# Altium schematic sheet top.SchDoc
size A4; SheetNumber: 1; SheetTotal: 1
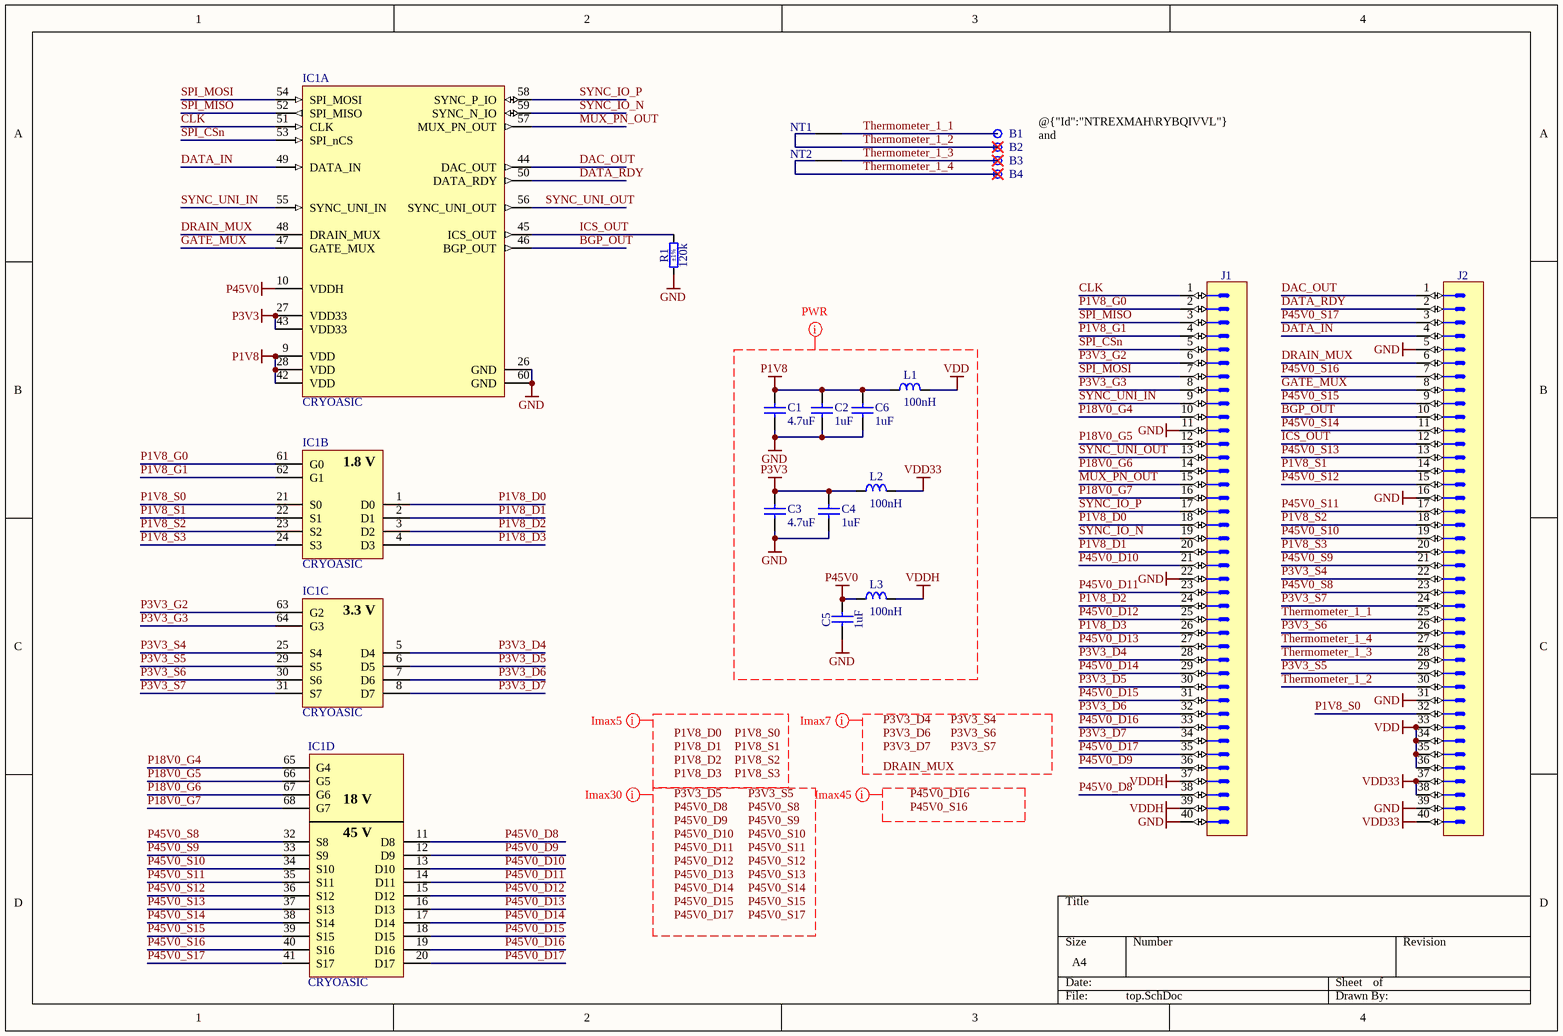
[diagram p0: top.SchDoc]

## Parts
B1  Plated Hole  [c100h50]  (value not drawn)  (no BOM)
B2  Plated Hole  [c100h50]  (value not drawn)  (no BOM)
B3  Plated Hole  [c100h50]  (value not drawn)  (no BOM)
B4  Plated Hole  [c100h50]  (value not drawn)  (no BOM)
C1  4.7uF  [CAPC1005X55N]
C2  1uF  [CAPC1005X55N]
C3  4.7uF  [CAPC1005X55N]
C4  1uF  [CAPC1005X55N]
C5  1uF  [CAPC2013X145N]
C6  1uF  [CAPC1005X55N]
IC1  CRYOASIC  [FP-FJ0068A-IPC_A]  (parts A,B,C,D of 4)
J1  Header 40  [SAMTEC_HDWM-20-54-L-D-335-SM-P]  (value not drawn)
J2  Header 40  [SAMTEC_HDWM-20-54-L-D-335-SM-P]  (value not drawn)
L1  100nH  [INDC1005X55N]
L2  100nH  [INDC1005X55N]
L3  100nH  [INDC1005X55N]
NT1  Net Tie  [Net Tie]  (value not drawn)  (net tie, no BOM)
NT2  Net Tie  [Net Tie]  (value not drawn)  (net tie, no BOM)
R1  120k  Tolerance: ±1%  [RESC1005X40N]

## Nets
GND: C1.2 C2.2 C3.2 C4.2 C5.1 C6.2 IC1.26(GND) IC1.60(GND) J1.11 J1.22 J1.40 J2.5 J2.16 J2.31 J2.39 R1.1
P1V8: C1.1 C2.1 C6.1 IC1.9(VDD) IC1.28(VDD) IC1.42(VDD) L1.1
P3V3: C3.1 C4.1 IC1.27(VDD33) IC1.43(VDD33) L2.1
P45V0: C5.2 IC1.10(VDDH) L3.1
VDD: J2.33 J2.34 J2.35 J2.36 L1.2
VDD33: J2.37 J2.38 J2.40 L2.2
VDDH: J1.37 J1.39 L3.2
BGP_OUT: IC1.46(BGP_OUT) J2.10
CLK: IC1.51(CLK) J1.1
DAC_OUT: IC1.44(DAC_OUT) J2.1
DATA_IN: IC1.49(DATA_IN) J2.4
DATA_RDY: IC1.50(DATA_RDY) J2.2
DRAIN_MUX: IC1.48(DRAIN_MUX) J2.6
GATE_MUX: IC1.47(GATE_MUX) J2.8
ICS_OUT: IC1.45(ICS_OUT) J2.12 R1.2
MUX_PN_OUT: IC1.57(MUX_PN_OUT) J1.15
P1V8_D0: IC1.1(D0) J1.18
P1V8_D1: IC1.2(D1) J1.20
P1V8_D2: IC1.3(D2) J1.24
P1V8_D3: IC1.4(D3) J1.26
P1V8_G0: IC1.61(G0) J1.2
P1V8_G1: IC1.62(G1) J1.4
P1V8_S0: IC1.21(S0) J2.32
P1V8_S1: IC1.22(S1) J2.14
P1V8_S2: IC1.23(S2) J2.18
P1V8_S3: IC1.24(S3) J2.20
P3V3_D4: IC1.5(D4) J1.28
P3V3_D5: IC1.6(D5) J1.30
P3V3_D6: IC1.7(D6) J1.32
P3V3_D7: IC1.8(D7) J1.34
P3V3_G2: IC1.63(G2) J1.6
P3V3_G3: IC1.64(G3) J1.8
P3V3_S4: IC1.25(S4) J2.22
P3V3_S5: IC1.29(S5) J2.29
P3V3_S6: IC1.30(S6) J2.26
P3V3_S7: IC1.31(S7) J2.24
P18V0_G4: IC1.65(G4) J1.10
P18V0_G5: IC1.66(G5) J1.12
P18V0_G6: IC1.67(G6) J1.14
P18V0_G7: IC1.68(G7) J1.16
P45V0_D8: IC1.11(D8) J1.38
P45V0_D9: IC1.12(D9) J1.36
P45V0_D10: IC1.13(D10) J1.21
P45V0_D11: IC1.14(D11) J1.23
P45V0_D12: IC1.15(D12) J1.25
P45V0_D13: IC1.16(D13) J1.27
P45V0_D14: IC1.17(D14) J1.29
P45V0_D15: IC1.18(D15) J1.31
P45V0_D16: IC1.19(D16) J1.33
P45V0_D17: IC1.20(D17) J1.35
P45V0_S8: IC1.32(S8) J2.23
P45V0_S9: IC1.33(S9) J2.21
P45V0_S10: IC1.34(S10) J2.19
P45V0_S11: IC1.35(S11) J2.17
P45V0_S12: IC1.36(S12) J2.15
P45V0_S13: IC1.37(S13) J2.13
P45V0_S14: IC1.38(S14) J2.11
P45V0_S15: IC1.39(S15) J2.9
P45V0_S16: IC1.40(S16) J2.7
P45V0_S17: IC1.41(S17) J2.3
SPI_CSn: IC1.53(SPI_nCS) J1.5
SPI_MISO: IC1.52(SPI_MISO) J1.3
SPI_MOSI: IC1.54(SPI_MOSI) J1.7
SYNC_IO_N: IC1.59(SYNC_N_IO) J1.19
SYNC_IO_P: IC1.58(SYNC_P_IO) J1.17
SYNC_UNI_IN: IC1.55(SYNC_UNI_IN) J1.9
SYNC_UNI_OUT: IC1.56(SYNC_UNI_OUT) J1.13
Thermometer_1_1: B1.1 J2.25 NT1.2
Thermometer_1_2: B2.1 J2.30 NT1.1
Thermometer_1_3: B3.1 J2.28 NT2.2
Thermometer_1_4: B4.1 J2.27 NT2.1

## Layout directives
net class PWR: GND, P1V8, P3V3, P45V0, VDD, VDD33, VDDH
net class Imax5: P1V8_D0, P1V8_D1, P1V8_D2, P1V8_D3, P1V8_S0, P1V8_S1, P1V8_S2, P1V8_S3
net class Imax7: DRAIN_MUX, P3V3_D4, P3V3_D6, P3V3_D7, P3V3_S4, P3V3_S6, P3V3_S7
net class Imax30: P3V3_D5, P3V3_S5, P45V0_D8, P45V0_D9, P45V0_D10, P45V0_D11, P45V0_D12, P45V0_D13, P45V0_D14, P45V0_D15, P45V0_D17, P45V0_S8, P45V0_S9, P45V0_S10, P45V0_S11, P45V0_S12, P45V0_S13, P45V0_S14, P45V0_S15, P45V0_S17
net class Imax45: P45V0_D16, P45V0_S16

## Notes on the sheet
- @{"Id":"NTREXMAH\RYBQIVVL"} and @{"Id":"NTREXMAH\FSQBBUAX"}: V+/- to diode
  @{"Id":"NTREXMAH\DWSTYFZM"} and @{"Id":"NTREXMAH\UVDVJTMM"}: I+/- to diode
- Labels drawn without touching a wire or pin: DRAIN_MUX, P1V8_D0, P1V8_D1, P1V8_D2, P1V8_D3, P1V8_S0, P1V8_S1, P1V8_S2, P1V8_S3, P3V3_D4, P3V3_D5, P3V3_D6, P3V3_D7, P3V3_S4, P3V3_S5, P3V3_S6, P3V3_S7, P45V0_D8, P45V0_D9, P45V0_D10, P45V0_D11, P45V0_D12, P45V0_D13, P45V0_D14, P45V0_D15, P45V0_D16, P45V0_D17, P45V0_S8, P45V0_S9, P45V0_S10, P45V0_S11, P45V0_S12, P45V0_S13, P45V0_S14, P45V0_S15, P45V0_S16, P45V0_S17
- (in symbol CRYOASIC, part B) 1.8 V
- (in symbol CRYOASIC, part C) 3.3 V
- (in symbol CRYOASIC, part D) 18 V; 45 V

## Library data of the parts
B1-B4 = PLATED_HOLE0.5_PAD1.0: Single Terminal Socket; Part Description: Plated Through Hole: Hole Dia.=0.5mm Pad Dia.=1.0mm; Mounted: No; Part Number: PLATED_HOLE0.5_PAD1.0; Component Type: Standard (No BOM); Pin Count: 1; Family: Plated Hole; Socket: No; SMD: No; Sense: No; Status: None; ComponentHeight: 0mm; HelpURL: Undefined; Author: CERN DEM JMW; CreateDate: 06.01.2020; LatestRevisionDate: 06.01.2020; PackageDescription: Plated Through Hole: Hole Dia.=0.5mm Pad Dia.=1.0mm
C1 C3 = CC0402_4.7UF_10V_10%_X5R: Non-polarised capacitor; Part Description: SMD Multilayer Chip Ceramic Capacitor; Manufacturer: GENERIC; Manufacturer1 Part Number: C1005X5R1A475K050; Voltage: 10V; TC: X5R; Tolerance: ±10%; Value: 4.7uF; Part Number: CC0402_4.7UF_10V_10%_X5R; Component Kind: Standard; Component Type: Standard; Pin Count: 2; Status: Preferred; Manufacturer Part Number: CC0402_4.7UF_10V_10%_X5R; Case: 0402; Mounted: Yes; Socket: No; SMD: Yes; Sense: No; Manufacturer1 Example: TDK; Manufacturer1 ComponentHeight: 0.65mm; HelpURL: \\cern.ch\dfs\Applications\Altium\Datasheets\CC0402_X5R_TDK_C.pdf; Author: CERN DEM BC; CreateDate: 10.01.2020; LatestRevisionDate: 10.01.2020
C2 C4 C6 = CC0402_1UF_16V_10%_X5R: Non-polarised capacitor; Part Description: SMD Multilayer Chip Ceramic Capacitor; Manufacturer: GENERIC; Manufacturer1 Part Number: C1005X5R1C105KT; Voltage: 16V; TC: X5R; Tolerance: ±10%; Value: 1uF; Part Number: CC0402_1UF_16V_10%_X5R; Component Kind: Standard; Component Type: Standard; Pin Count: 2; Status: Preferred; Manufacturer Part Number: CC0402_1UF_16V_10%_X5R; Case: 0402; Mounted: Yes; Socket: No; SMD: Yes; Sense: No; Manufacturer1 Example: TDK; Manufacturer1 ComponentHeight: 0.55mm; HelpURL: \\cern.ch\dfs\Applications\Altium\Datasheets\CC0402_X5R_TDK_C.pdf; Author: CERN DEM JLC; CreateDate: 25.10.2012; LatestRevisionDate: 25.10.2012
C5 = CC0805_1UF_100V_10%_X7S: Non-polarised capacitor; Part Description: SMD Multilayer Chip Ceramic Capacitor; Manufacturer: TDK; Manufacturer Part Number: C2012X7S2A105K125AB; Voltage: 100V; TC: X7S; Tolerance: ±10%; Part Number: CC0805_1UF_100V_10%_X7S; Component Kind: Standard; Component Type: Standard; Pin Count: 2; Value: 1uF; Status: None; Case: 0805; Mounted: Yes; Socket: No; SMD: Yes; Sense: No; ComponentHeight: 1.45mm; HelpURL: \\cern.ch\dfs\Applications\Altium\Datasheets\CC0805_X7S_TDK_C.pdf; Author: CERN DEM JLC; CreateDate: 12.12.2013; LatestRevisionDate: 20.01.2015
IC1 = CRYOASIC: CRYOASIC_TEST1
J1 J2 = SAMTEC_HDWM-20-54-L-D-335-SM-P: Connector 40 Male; Part Description: 40 Contacts, Pitch 1.27mm, Dual Row Straight SMD Micro Board Stacker (Stacker Height = 8.509mm); Manufacturer: SAMTEC; PressFit: No; Part Number: SAMTEC_HDWM-20-54-L-D-335-SM-P; Component Kind: Standard; Component Type: Standard; Pin Count: 40; Family: Header 40; Mounted: Yes; Socket: No; SMD: Yes; Sense: No; Status: None; Manufacturer Part Number: HDWM-20-54-L-D-335-SM-P; ComponentHeight: 11.05mm; HelpURL: \\cern.ch\dfs\Applications\Altium\Datasheets\SAMTEC_HDWM-20-54-L-D-335-SM-P.pdf; Author: CERN DEM JLC; CreateDate: 09.01.2013; LatestRevisionDate: 09.01.2013; System: Connector
L1-L3 = IND0402_100NH_5%_TDK_MLJ1005: Inductor; Part Description: SMD Inductor for Standard Circuits, MLJ Series; Manufacturer: TDK; Manufacturer Part Number: MLJ1005WR10J; Power: 400mA; Resistance: 0.30R; Tolerance: ±5%; Value: 100nH; Part Number: IND0402_100NH_5%_TDK_MLJ1005; Component Kind: Standard; Component Type: Standard; Pin Count: 2; Case: 0402; Mounted: Yes; Socket: No; SMD: Yes; Sense: No; ComponentHeight: 0.55mm; HelpURL: \\cern.ch\dfs\Applications\Altium\Datasheets\IND0402_TDK_MLJ1005.pdf; Author: CERN DEM BC; CreateDate: 13.07.2020; LatestRevisionDate: 13.07.2020
NT1 NT2 = Net Tie: Part Description: Net Tie (2 Nets); Mounted: No; Part Number: Net Tie; Component Type: Net Tie; Pin Count: 2; Family: Net Tie; Socket: No; SMD: No; Sense: No; Status: None; ComponentHeight: 0mm; HelpURL: Undefined; Author: CERN DEM JLC; CreateDate: 22.03.2011; LatestRevisionDate: 22.03.2011; PackageDescription: 2 Plated Through Hole For Coaxial Cable Link: Hole Dia.=1.4mm Pad Dia.=2.5mm
R1 = R0402_120K_1%_0.0625W_100PPM: Resistor - 1%; Part Description: General Purpose Thick Film Chip Resistor; Manufacturer: GENERIC; Manufacturer1 Part Number: 232270671204L; TC: ±100ppm/°C; PressFit: No; Part Number: R0402_120K_1%_0.0625W_100PPM; Component Kind: Standard; Component Type: Standard; Pin Count: 2; Value: 120k; Status: Not Recommended; Power: 0.0625W; Manufacturer Part Number: R0402_120K_1%_0.0625W_100PPM; Case: 0402; Mounted: Yes; Sense: No; Socket: No; SMD: Yes; Manufacturer1 Example: YAGEO PHYCOMP; Manufacturer1 ComponentHeight: 0.4mm; HelpURL: \\cern.ch\dfs\Applications\Altium\Datasheets\R0402_Phycomp_RC0402.pdf; Author: CERN DEM JLC; CreateDate: 03.12.2007; LatestRevisionDate: 17.10.2012